# EAGLE design untitled (EAGLE 8.6.0)
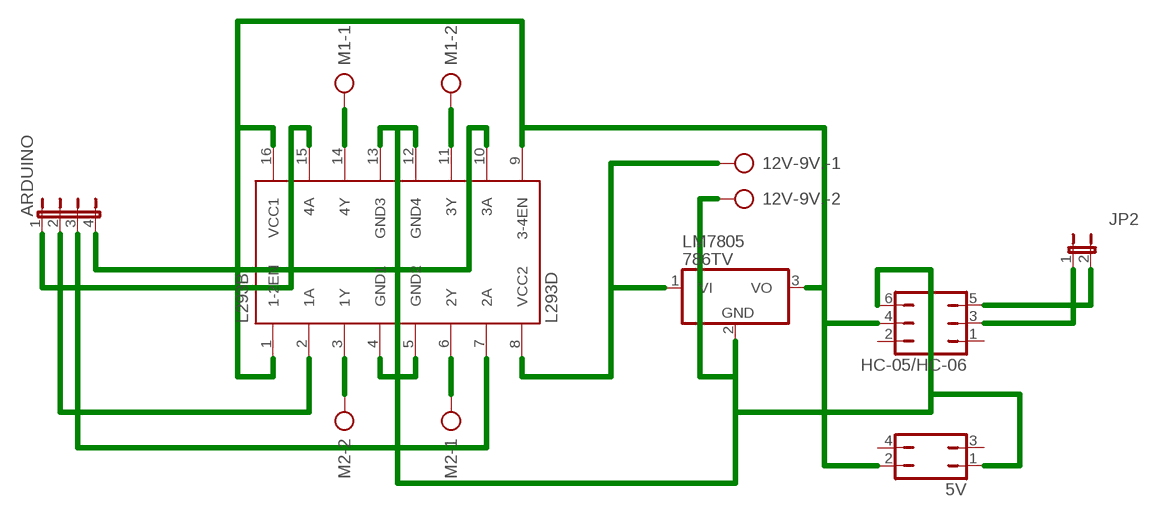
[diagram p0: schematic, sheet 1]

## Parts
5V  JP2Q  [5V-ARDUINO-OKIOKIS]
12V-9V.  AK300/2-OKIS  [AK300/2-OKIS]
ARDUINO  JP4E  [ARDUINO-2021-0KIS-SI-O-SI]
HC-05/HC-06  JP3Q  [HC-05-HC-06-OKISOKISS]
JP2  JP1E  [2-PINES-OK-2021-TX-RX]
L293B  L293D  [DIL16]
LM7805  786TV  [LM7812/OK]
M1  AK300/2-OKIS  [AK300/2-OKIS]
M2  AK300/2-OKIS  [AK300/2-OKIS]

## Nets
N$1: L293B.14(4Y) M1.1
N$2: L293B.11(3Y) M1.2
N$3: L293B.3(1Y) M2.2
N$4: L293B.6(2Y) M2.1
N$5: HC-05/HC-06.3 JP2.1
N$6: 5V.1 12V-9V..2 HC-05/HC-06.6 L293B.4(GND1) L293B.5(GND2) L293B.12(GND4) L293B.13(GND3) LM7805.2(GND)
N$8: 12V-9V..1 L293B.8(VCC2) LM7805.1(VI)
N$9: HC-05/HC-06.5 JP2.2
N$10: ARDUINO.2 L293B.2(1A)
N$11: ARDUINO.3 L293B.7(2A)
N$12: ARDUINO.1 L293B.15(4A)
N$13: ARDUINO.4 L293B.10(3A)
N$14: 5V.2 HC-05/HC-06.4 L293B.1(1-2EN) L293B.9(3-4EN) L293B.16(VCC1) LM7805.3(VO)
Unconnected: 5V.3 5V.4 HC-05/HC-06.1 HC-05/HC-06.2

## Library data of the parts
5V = jumper:JP2Q: JUMPER
12V-9V. M1 M2 = con-ptr500:AK300/2-OKIS: CONNECTOR; OC_FARNELL: unknown; OC_NEWARK: unknown
ARDUINO = jumper:JP4E: JUMPER
HC-05/HC-06 = jumper:JP3Q: JUMPER
JP2 = jumper:JP1E: JUMPER
L293B = st-microelectronics:L293D: PUSH-PULL 4 CHANNEL DRIVER; MPN: L293D; OC_FARNELL: 9589619; OC_NEWARK: 56P8249
LM7805 = linear:78*: Positive VOLTAGE REGULATOR Source: http://cache.national.com/ds/LM/LM78L05.pdf http://www.fairchildsemi.com/ds/LM/LM7805.pdf

## Board
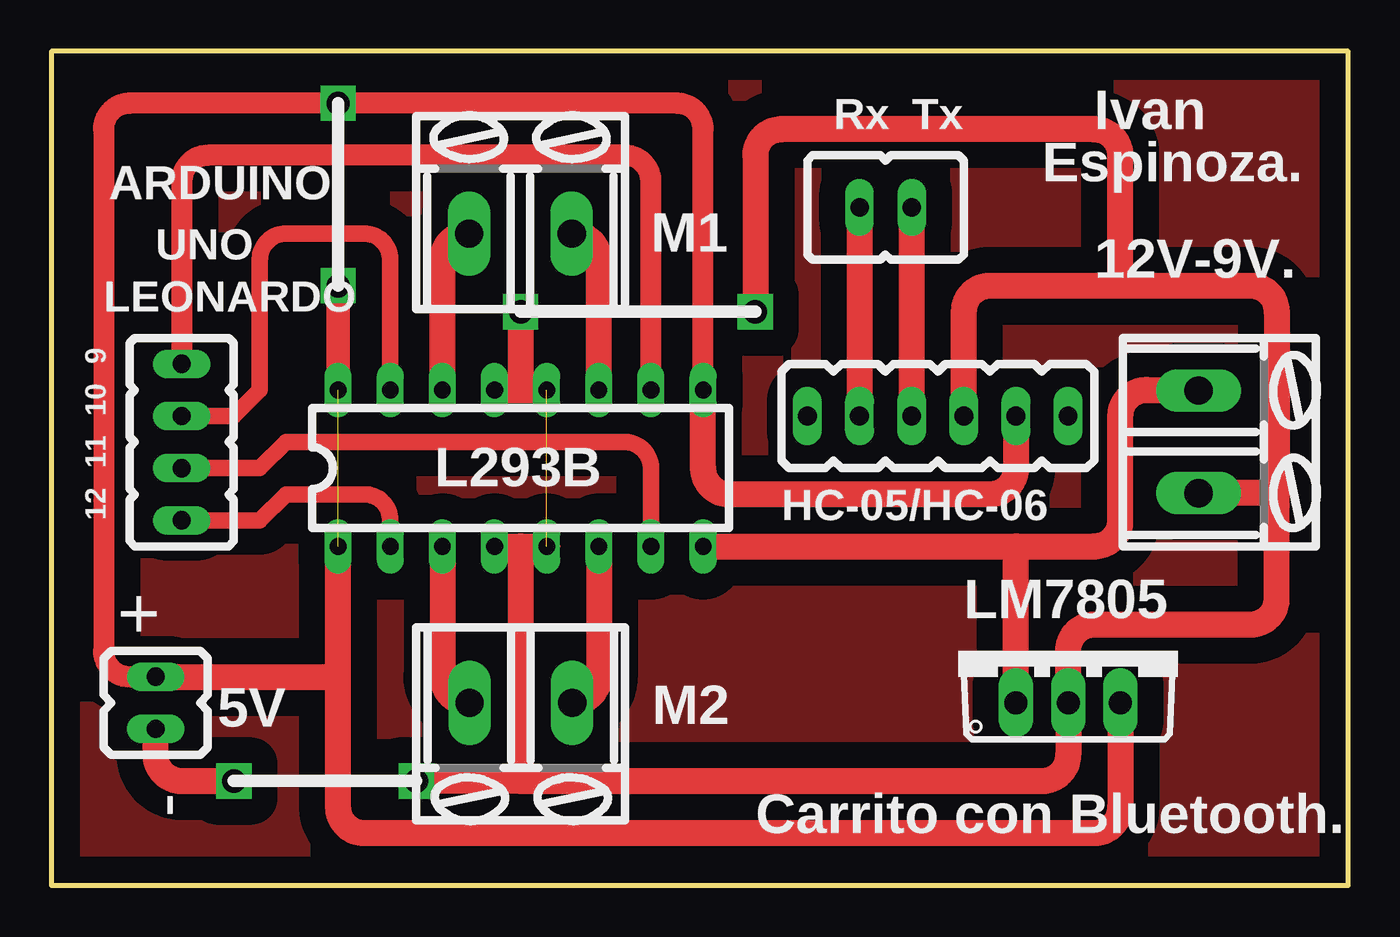
[diagram p1: board, top side]

Size 63.17 x 40.63 mm. Coordinates in mm from the lower left corner, seen from the top.
Outline: 0,0 63.17,0 63.17,40.63 0,40.63 0,0
Copper layers (1*16): Top 0.035mm / dielectric 1.5mm / Bottom 0.035mm
Design rules "default": minimum track width 6mil, minimum drill 0.35mm, track to track 6mil, track to pad 6mil, pad to pad 6mil, via to via 6mil, smd to smd 6mil, copper to edge 40mil, drill to drill 6mil, minimum pad ring 10mil, minimum via ring 8mil, stop-mask expansion 4mil, vias tented up to drill 0mil, thermal gap 10mil

### Footprints (pad centres in the part's own frame; a part is rotated, then mirrored left to right if it is on the bottom)
5V-ARDUINO-OKIOKIS = drill 0.889 long: 1 -1.27,-1.27; 2 1.27,-1.27; 3 -1.27,-1.27; 4 1.27,-1.27
AK300/2-OKIS = drill 1.372 long: 1 -2.515,-2.54; 2 2.489,-2.54
ARDUINO-2021-0KIS-SI-O-SI = drill 0.889 pad 1.27 long: 1 1.27,0; 2 -3.81,0; 3 -1.27,0; 4 3.81,0
HC-05-HC-06-OKISOKISS = drill 0.914 long: 1 -6.35,0; 2 6.35,0; 3 -3.81,0; 4 3.81,0; 5 -1.27,0; 6 1.27,0
2-PINES-OK-2021-TX-RX = drill 0.889 pad 1.27 long: 1 -1.27,-1.27; 2 1.27,-1.27
DIL16 = drill 0.813 long: 1 -8.89,-3.81; 2 -6.35,-3.81; 3 -3.81,-3.81; 4 -1.27,-3.81; 5 1.27,-3.81; 6 3.81,-3.81; 7 6.35,-3.81; 8 8.89,-3.81; 9 8.89,3.81; 10 6.35,3.81; 11 3.81,3.81; 12 1.27,3.81; 13 -1.27,3.81; 14 -3.81,3.81; 15 -6.35,3.81; 16 -8.89,3.81
LM7812/OK = drill 1.118 long: 1 -2.54,-2.54; 2 0,-2.54; 3 2.54,-2.54

### Placement (x,y rotation side)
5V  3.81,8.89 90 top
12V-9V.  58.42,21.59 270 top
ARDUINO  6.35,21.59 90 top
HC-05/HC-06  43.18,22.86 0 top
JP2  40.64,34.29 0 top
L293B  22.86,20.32 0 top
LM7805  49.53,11.43 0 top
M1  22.86,34.29 0 top
M2  22.86,6.35 180 top

### Tracks (layer width: path | path; a pad name or v marks a point on that pad's centre or on a via)
N$1
  Top 1.27: L293B.14 19.05,30.48 arc-90 20.32,31.75 M1.1
N$2
  Top 1.27: L293B.11 26.67,30.48 arc90 25.4,31.75 M1.2
N$3
  Top 1.27: L293B.3 19.05,10.16 arc90 20.32,8.89 M2.2
N$4
  Top 1.27: L293B.6 26.67,10.16 arc-90 25.4,8.89 M2.1
N$5
  Top 1.27: JP2.1 HC-05/HC-06.3
N$6  (2 unrouted)
  Top 0.152: 24.74,16.51 L293B.5 | 55.98,19.1 12V-9V..2
  Top 1.27: 59.69,19.1 55.98,19.1 | 59.69,19.1 59.69,13.97 arc-90 58.42,12.7 50.8,12.7 arc90 49.53,11.43 LM7805.2 49.53,6.35 arc-90 48.26,5.08 22.86,5.08 | HC-05/HC-06.6 44.45,27.94 arc-90 45.72,29.21 52.07,29.21 | 52.07,29.21 58.42,29.21 arc-90 59.69,27.94 59.69,19.1 | L293B.4 22.86,16.51 | 22.86,16.51 L293B.5 | L293B.13 22.86,24.13 | 22.86,24.13 L293B.12 | 22.86,16.51 22.86,5.08 | 5V.1 5.08,6.35 arc90 6.35,5.08 8.89,5.08 | 22.86,5.08 17.78,5.08 | 52.07,29.21 52.07,35.56 arc90 50.8,36.83 35.56,36.83 arc90 34.29,35.56 34.29,27.94 | 22.86,27.94 22.86,24.13
N$7  (via drill 1.14 pad 1.52)
  other vias: 17.78,5.08
N$8
  Top 1.27: L293B.8 46.99,16.51 | 46.99,16.51 50.8,16.51 arc90 52.07,17.78 52.07,22.86 arc-90 53.34,24.13 arc-1 12V-9V..1 | LM7805.1 46.99,16.51
N$9
  Top 1.27: HC-05/HC-06.5 JP2.2
N$10
  Top 0.813: L293B.2 16.51,17.78 arc90 15.24,19.05 11.43,19.05 10.16,17.78 ARDUINO.2
N$11
  Top 0.813: ARDUINO.3 10.16,20.32 11.43,21.59 27.94,21.59 arc-90 29.21,20.32 L293B.7
N$12
  Top 0.813: L293B.15 16.51,30.48 arc90 15.24,31.75 11.43,31.75 arc90 10.16,30.48 10.16,24.13 8.89,22.86 ARDUINO.1
N$13
  Top 1.016: L293B.10 29.21,34.29 arc90 27.94,35.56 7.62,35.56 arc90 6.35,34.29 ARDUINO.4
N$14  (1 unrouted)
  Top 1.016: L293B.9 31.75,36.83 arc90 30.48,38.1 3.81,38.1 arc90 2.54,36.83 2.54,11.43 arc90 3.81,10.16 5V.2
  Top 1.143: L293B.16 13.97,29.21
  Top 1.27: 13.97,10.16 L293B.1 | 5V.2 13.97,10.16 | HC-05/HC-06.4 46.99,20.32 arc-90 45.72,19.05 33.02,19.05 arc-90 31.75,20.32 L293B.9 | LM7805.3 52.07,3.81 arc-90 50.8,2.54 15.24,2.54 arc-90 13.97,3.81 13.97,10.16
N$15  (via drill 1.14 pad 1.52)
  other vias: 8.89,5.08
N$16  (via drill 1.14 pad 1.52)
  other vias: 34.29,27.94
N$17
  pour Top (isolate 1.27): 0,40.64 0,0 63.5,0 63.5,40.64
N$18  (via drill 1.14 pad 1.52)
  other vias: 13.97,38.1
N$19  (via drill 1.14 pad 1.52)
  other vias: 22.86,27.94
N$20  (via drill 1.14 pad 1.52)
  other vias: 13.97,29.21

### Text on the board
tPlace: Ivan | Espinoza. | UNO | LEONARDO | HC-05/HC-06 | Carrito con Bluetooth.